# EAGLE schematic r_series (EAGLE 9.5.1)
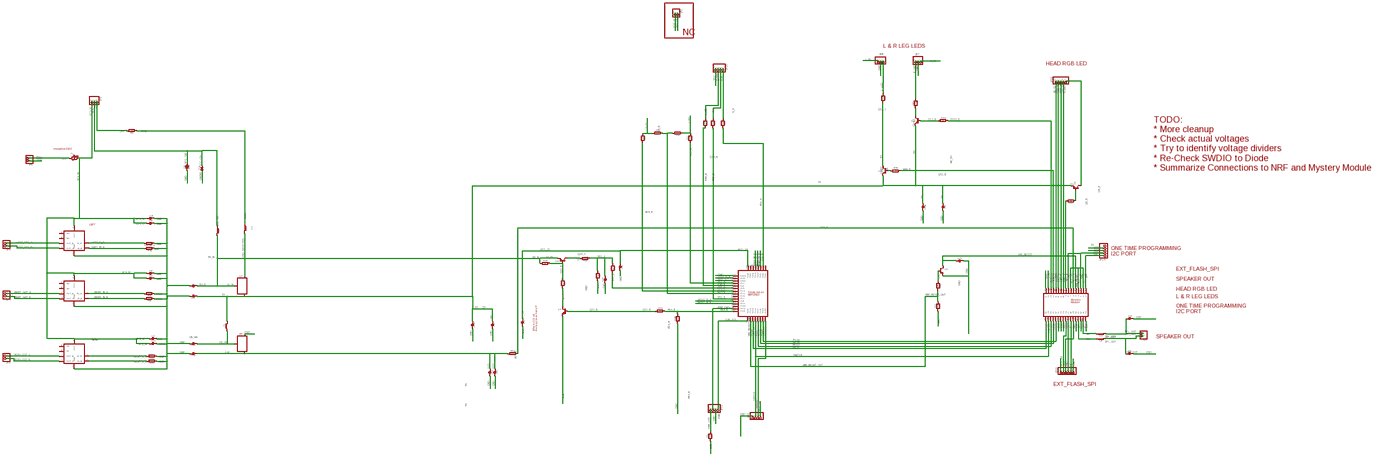
[diagram p0: schematic, sheet 1, overview]
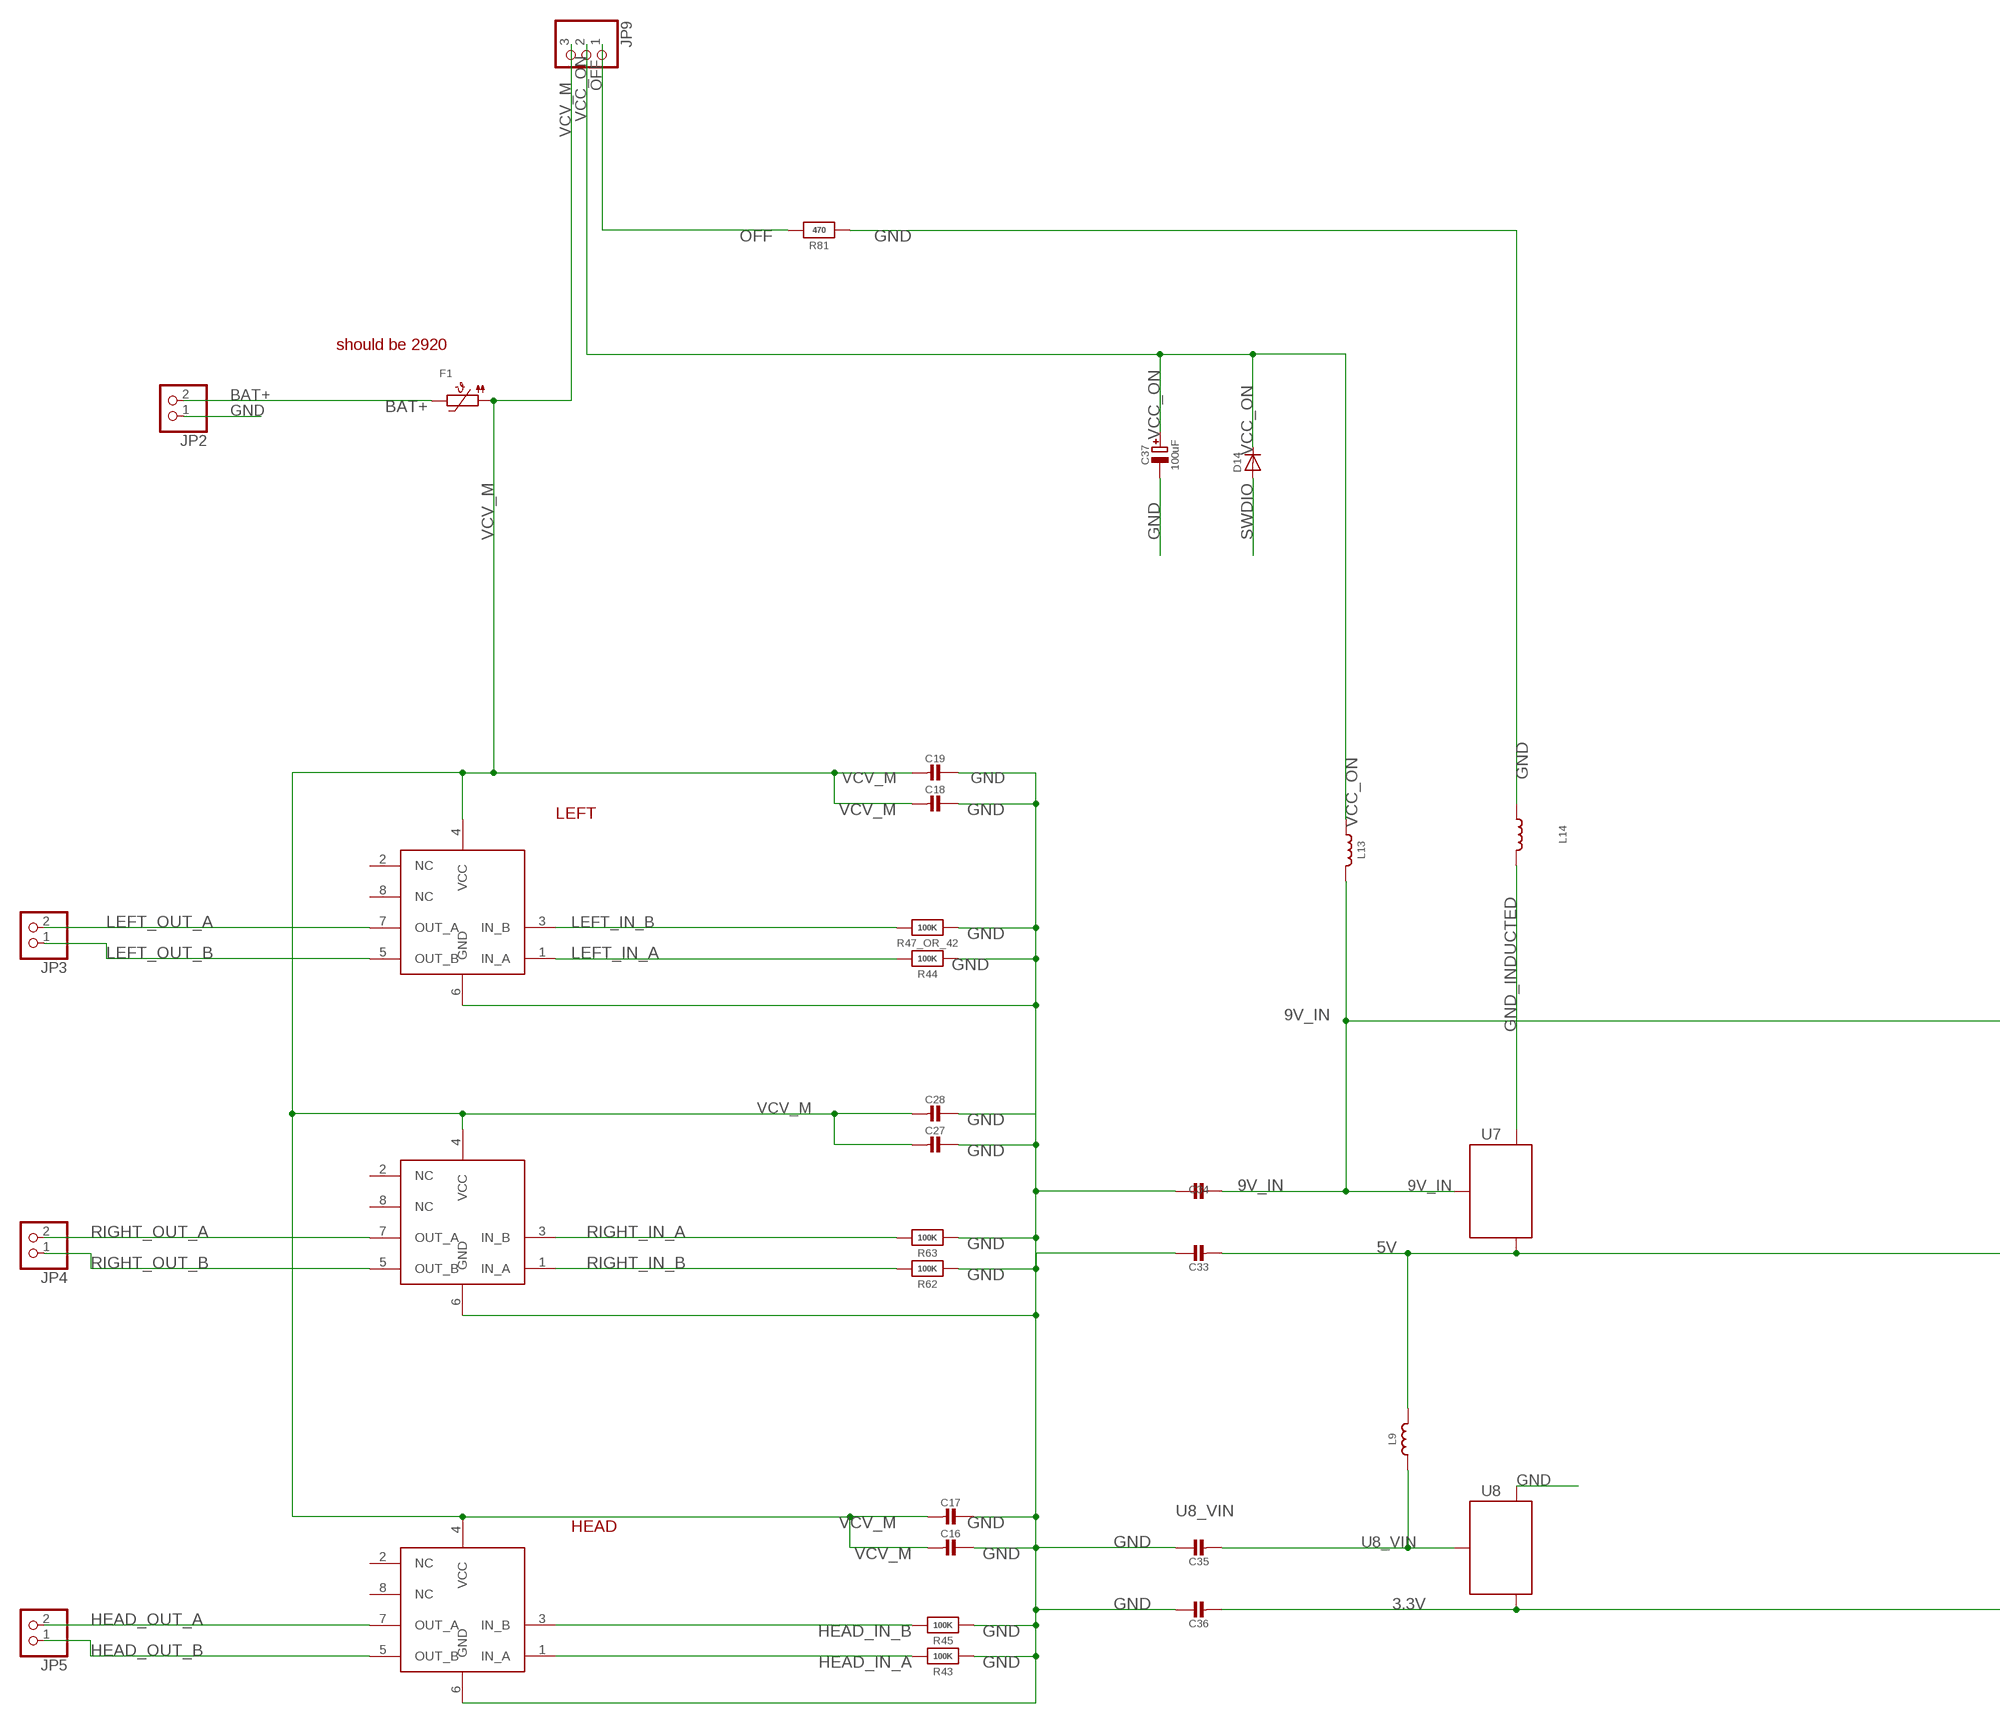
[diagram p1: schematic, sheet 1, part 1 of 4]
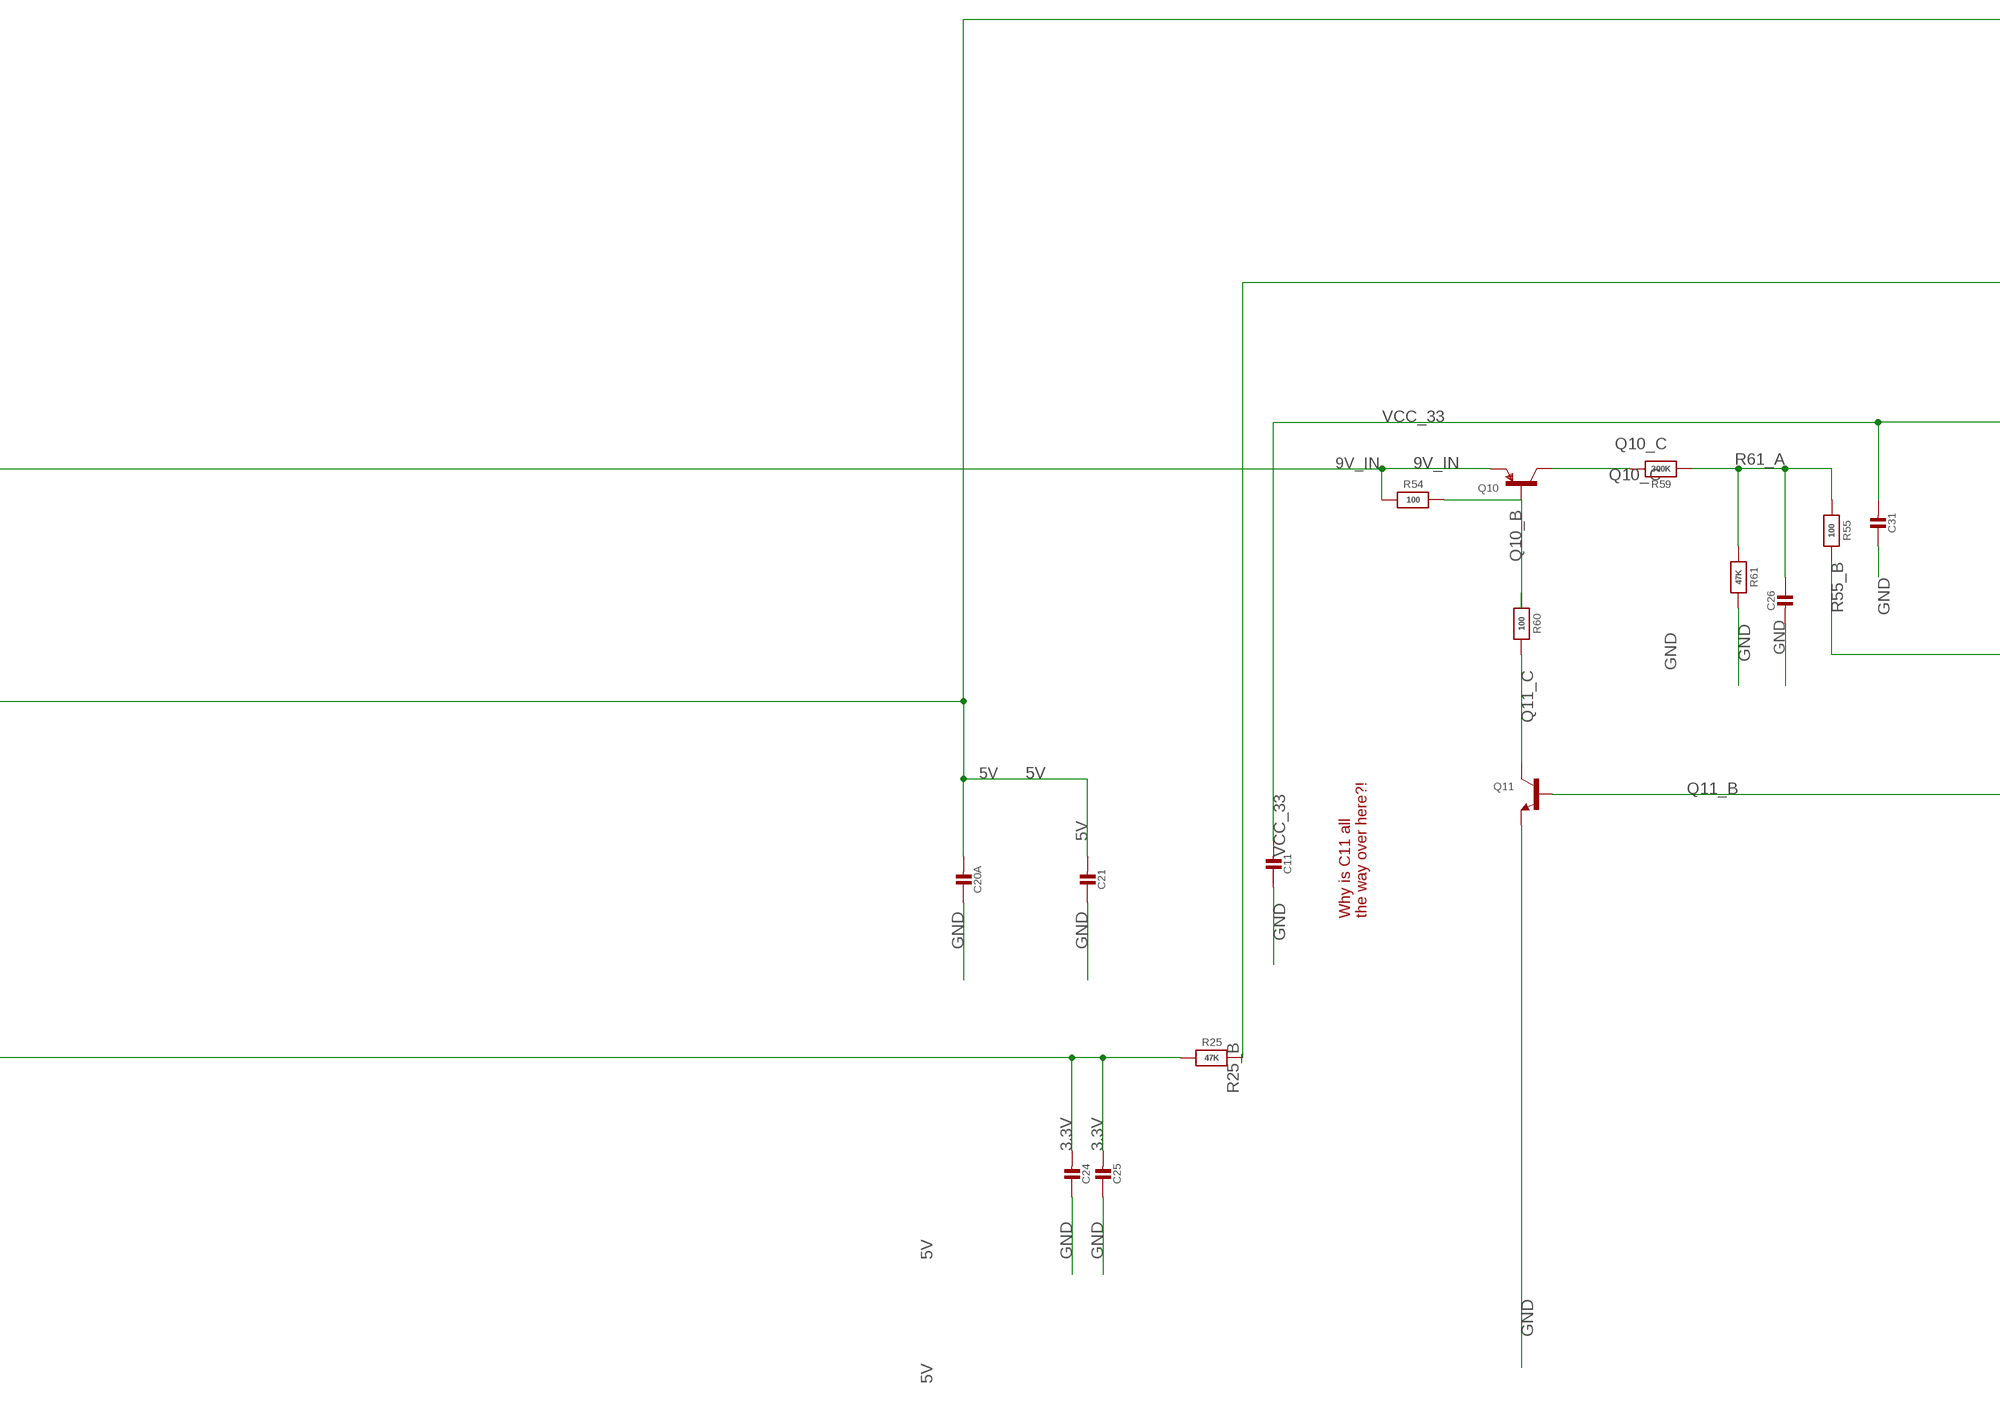
[diagram p2: schematic, sheet 1, part 2 of 4]
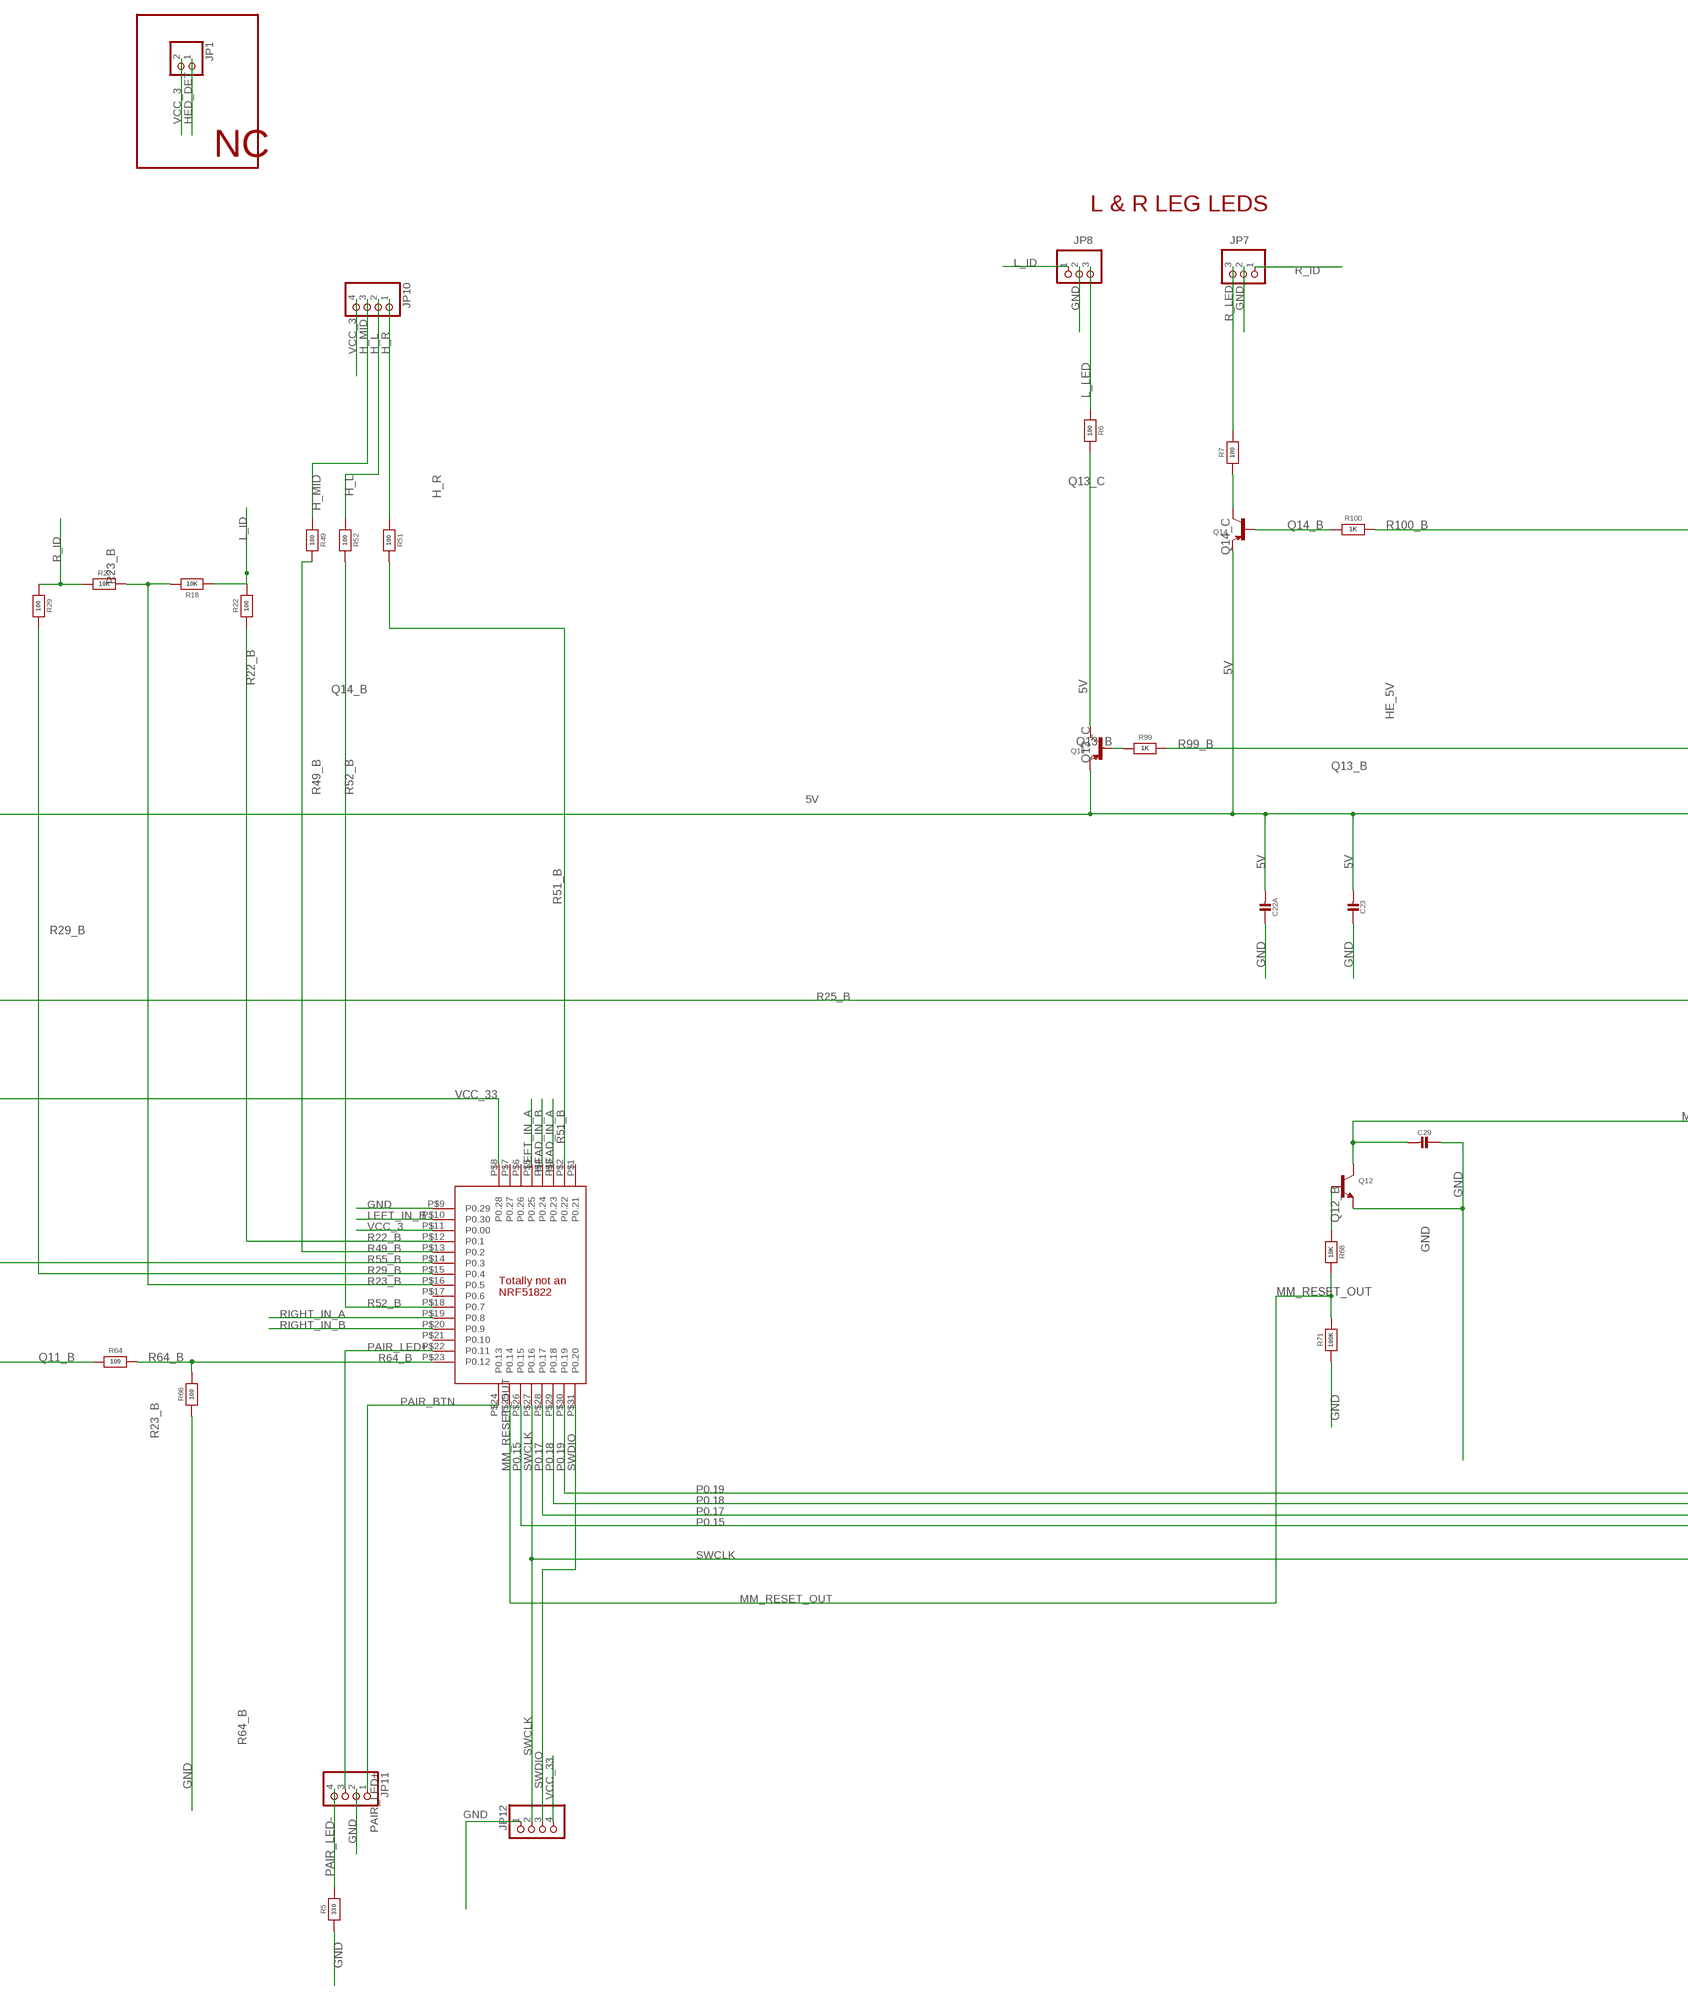
[diagram p3: schematic, sheet 1, part 3 of 4]
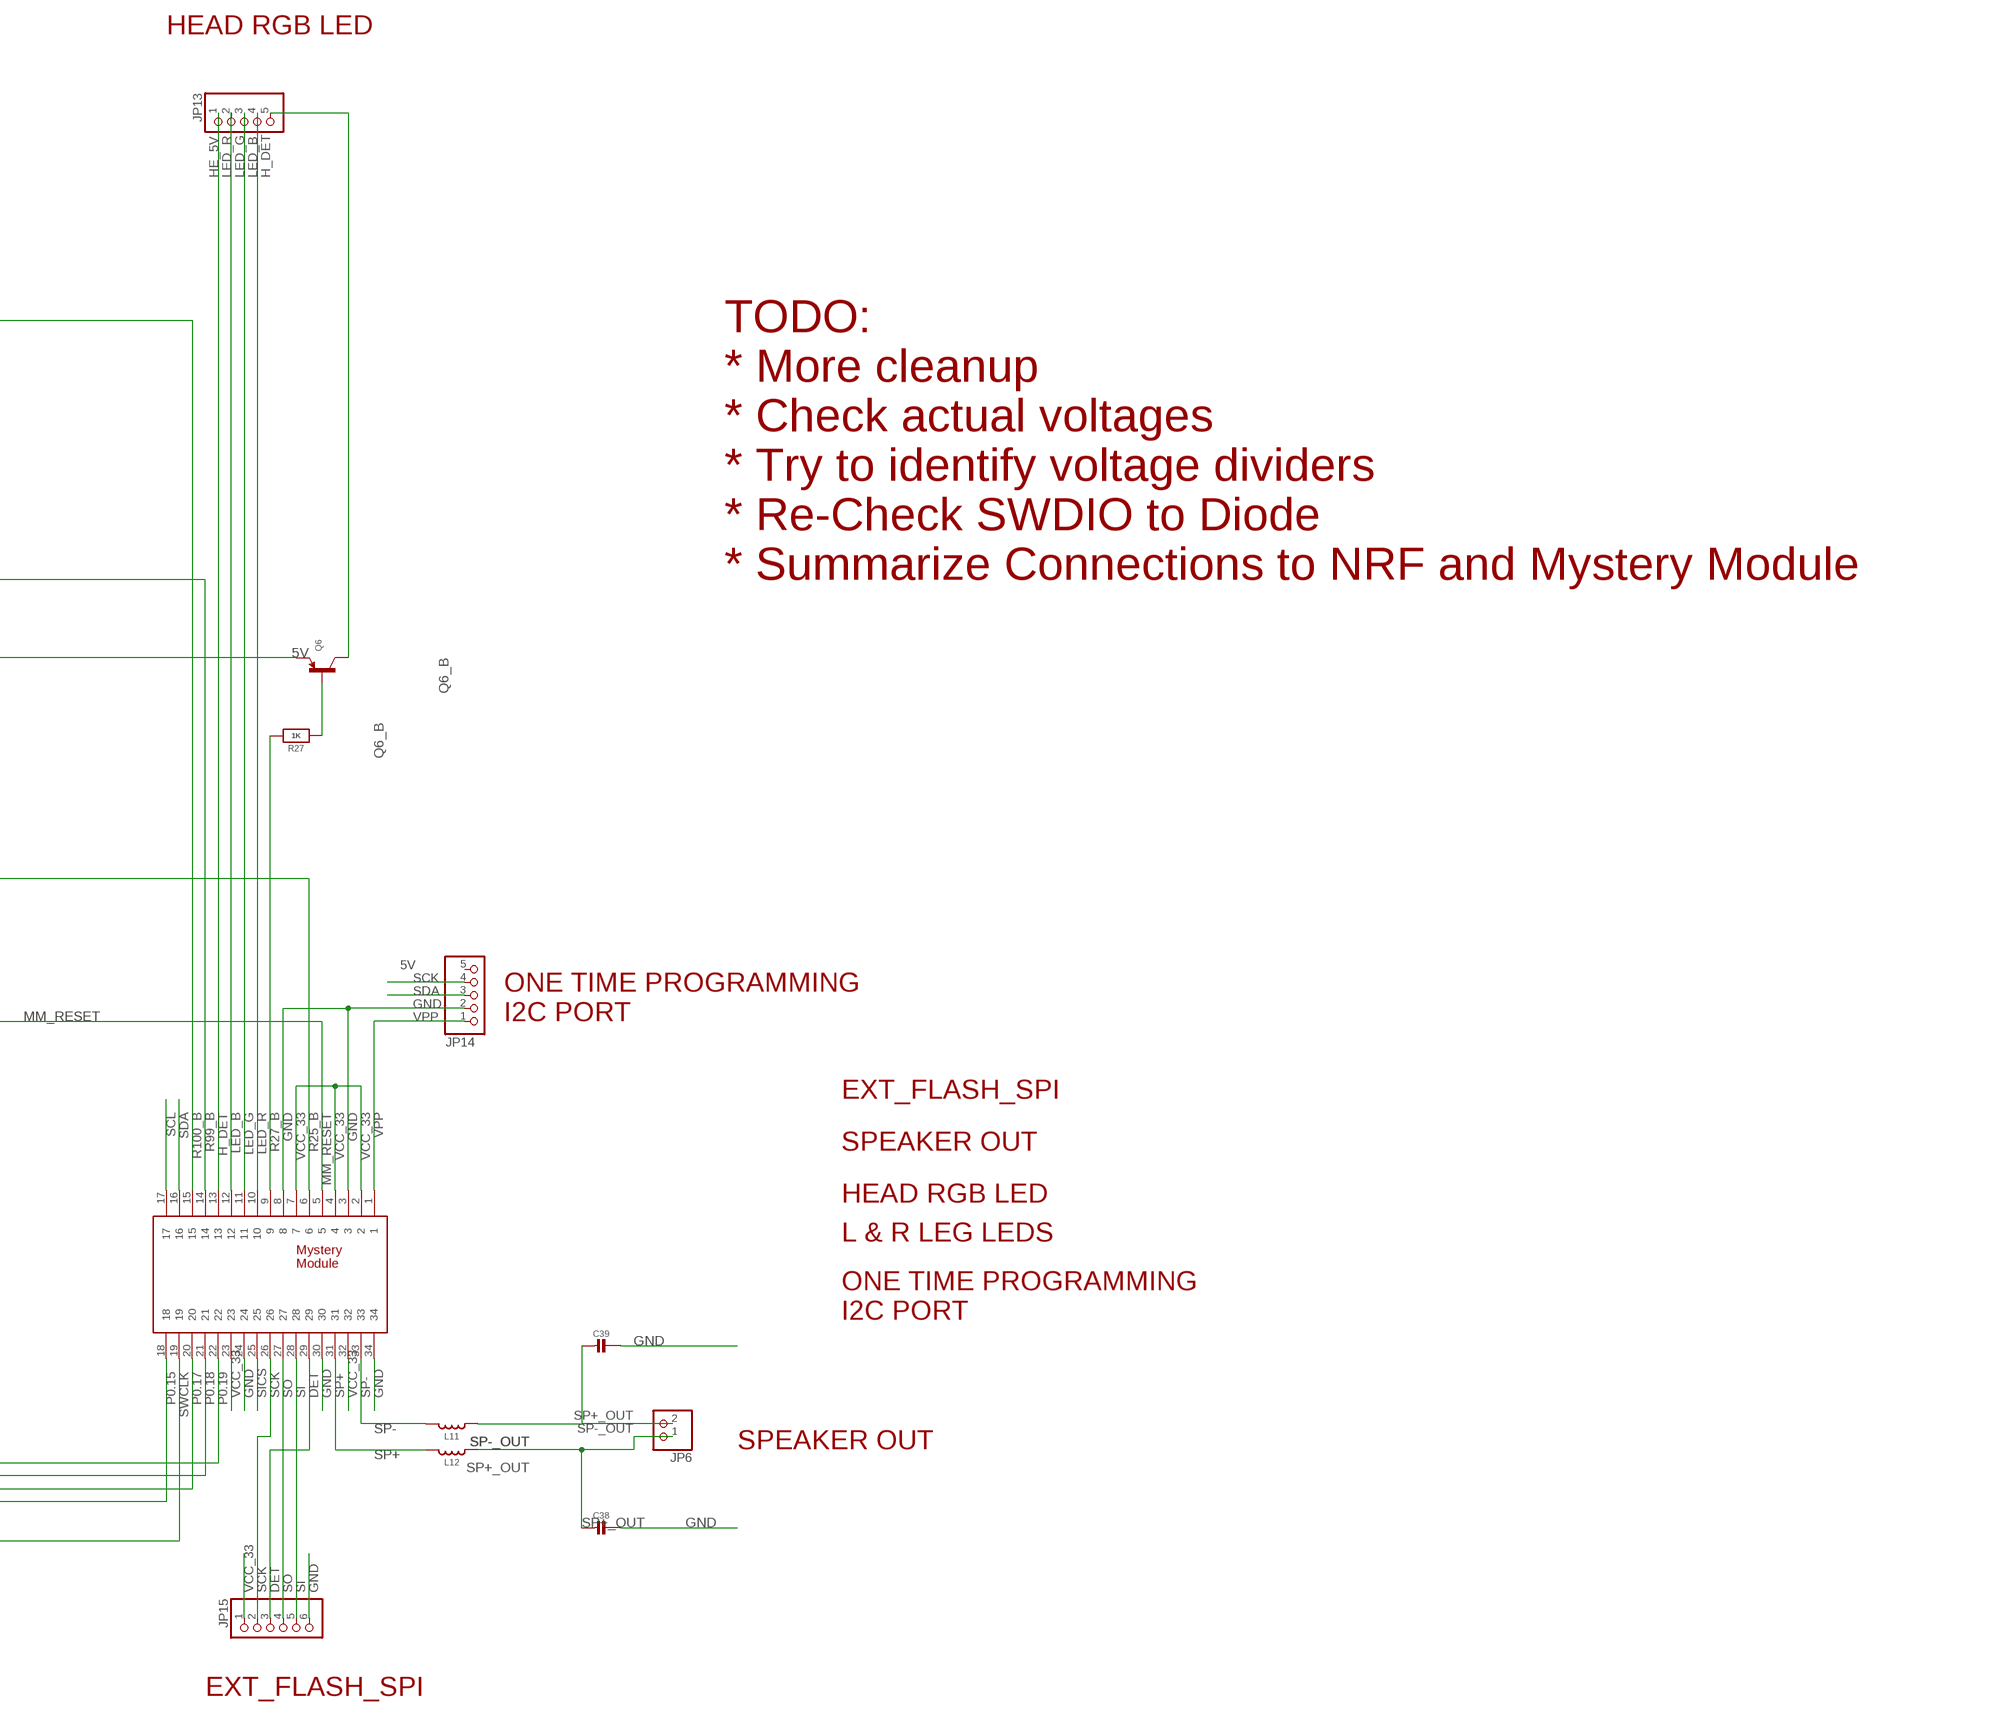
[diagram p4: schematic, sheet 1, part 4 of 4]

## Parts
C11  CAP_CERAMIC0603_NO  [0603-NO]
C16  CAP_CERAMIC0603_NO  [0603-NO]
C17  CAP_CERAMIC_0805MP  [_0805MP]
C18  CAP_CERAMIC0603_NO  [0603-NO]
C19  CAP_CERAMIC_0805MP  [_0805MP]
C20A  CAP_CERAMIC_0805MP  [_0805MP]
C21  CAP_CERAMIC0603_NO  [0603-NO]
C22A  CAP_CERAMIC_0805MP  [_0805MP]
C23  CAP_CERAMIC0603_NO  [0603-NO]
C24  CAP_CERAMIC0603_NO  [0603-NO]
C25  CAP_CERAMIC0603_NO  [0603-NO]
C26  CAP_CERAMIC0603_NO  [0603-NO]
C27  CAP_CERAMIC0603_NO  [0603-NO]
C28  CAP_CERAMIC_0805MP  [_0805MP]
C29  CAP_CERAMIC0603_NO  [0603-NO]
C31  CAP_CERAMIC0603_NO  [0603-NO]
C33  CAP_CERAMIC0603_NO  [0603-NO]
C34  CAP_CERAMIC0603_NO  [0603-NO]
C35  CAP_CERAMIC0603_NO  [0603-NO]
C36  CAP_CERAMIC0603_NO  [0603-NO]
C37  100uF  CAP_ELECTROLYTICPANASONIC_D  [PANASONIC_D]
C38  CAP_CERAMIC0603_NO  [0603-NO]
C39  CAP_CERAMIC0603_NO  [0603-NO]
D14  DIODESOD-323  [SOD-323]
F1  PTC1812  [PTC1812]
JP1  HEADER-1X2ROUND  [1X02_ROUND]
JP2  HEADER-1X2ROUND  [1X02_ROUND]
JP3  HEADER-1X2ROUND  [1X02_ROUND]
JP4  HEADER-1X2ROUND  [1X02_ROUND]
JP5  HEADER-1X2ROUND  [1X02_ROUND]
JP6  HEADER-1X2ROUND  [1X02_ROUND]
JP7  HEADER-1X3ROUND  [1X03_ROUND]
JP8  HEADER-1X3ROUND  [1X03_ROUND]
JP9  HEADER-1X3ROUND  [1X03_ROUND]
JP10  HEADER-1X4ROUND  [1X04_ROUND]
JP11  HEADER-1X4ROUND  [1X04_ROUND]
JP12  HEADER-1X4ROUND  [1X04_ROUND]
JP13  HEADER-1X5ROUND  [1X05_ROUND]
JP14  HEADER-1X5ROUND  [1X05_ROUND]
JP15  HEADER-1X6ROUND  [1X06_ROUND]
L9  INDUCTOR0805-NO  [0805-NO]
L11  INDUCTOR0603_NO  [0603-NO]
L12  INDUCTOR0603_NO  [0603-NO]
L13  INDUCTOR0805-NO  [0805-NO]
L14  INDUCTOR0805-NO  [0805-NO]
Q6  TRANSISTOR_PNPSOT23-REFLOW  [SOT23-R]
Q10  TRANSISTOR_PNPSOT23-REFLOW  [SOT23-R]
Q11  TRANSISTOR_NPNWIDE  [SOT23-WIDE]
Q12  TRANSISTOR_NPNWIDE  [SOT23-WIDE]
Q13  TRANSISTOR_PNPSOT23-REFLOW  [SOT23-R]
Q14  TRANSISTOR_PNPSOT23-REFLOW  [SOT23-R]
R5  330  RESISTOR_0603_NOOUT  [0603-NO]
R6  100  RESISTOR_0603_NOOUT  [0603-NO]
R7  100  RESISTOR_0603_NOOUT  [0603-NO]
R18  10K  RESISTOR_0603_NOOUT  [0603-NO]
R22  100  RESISTOR_0603_NOOUT  [0603-NO]
R23  10K  RESISTOR_0603_NOOUT  [0603-NO]
R25  47K  RESISTOR_0603_NOOUT  [0603-NO]
R27  1K  RESISTOR_0603_NOOUT  [0603-NO]
R29  100  RESISTOR_0603_NOOUT  [0603-NO]
R43  100K  RESISTOR_0603_NOOUT  [0603-NO]
R44  100K  RESISTOR_0603_NOOUT  [0603-NO]
R45  100K  RESISTOR_0603_NOOUT  [0603-NO]
R47_OR_42  100K  RESISTOR_0603_NOOUT  [0603-NO]
R49  100  RESISTOR_0603_NOOUT  [0603-NO]
R51  100  RESISTOR_0603_NOOUT  [0603-NO]
R52  100  RESISTOR_0603_NOOUT  [0603-NO]
R54  100  RESISTOR_0603_NOOUT  [0603-NO]
R55  100  RESISTOR_0603_NOOUT  [0603-NO]
R59  300K  RESISTOR_0603_NOOUT  [0603-NO]
R60  100  RESISTOR_0603_NOOUT  [0603-NO]
R61  47K  RESISTOR_0603_NOOUT  [0603-NO]
R62  100K  RESISTOR_0603_NOOUT  [0603-NO]
R63  100K  RESISTOR_0603_NOOUT  [0603-NO]
R64  100  RESISTOR_0603_NOOUT  [0603-NO]
R66  100  RESISTOR_0603_NOOUT  [0603-NO]
R68  10K  RESISTOR_0603_NOOUT  [0603-NO]
R71  100K  RESISTOR_0603_NOOUT  [0603-NO]
R81  470  RESISTOR_0805MP  [_0805MP]
R99  1K  RESISTOR_0603_NOOUT  [0603-NO]
R100  1K  RESISTOR_0603_NOOUT  [0603-NO]
U7  ME62XX  [SOT89]
U8  ME62XX  [SOT89]
U$1  AM1037A  [SOIC8_208MIL]
U$2  AM1037A  [SOIC8_208MIL]
U$3  AM1037A  [SOIC8_208MIL]
U$4  KNRF51822_A24  [KNRF51822]
U$5  GPCD9TP340A_DROID  [GPCD9TP340A]

## Nets
3.3V: C24.2 C25.2 C36.2 R25.1 U8.2(VOUT) U8.2@1(VOUT)
5V: C20A.2 C21.2 C22A.2 C23.2 C33.2 L9.2 Q6.2(E) Q13.2(E) Q14.2(E) U7.2(VOUT) U7.2@1(VOUT)
9V_IN: C34.2 L13.2 Q10.2(E) R54.1 U7.1(VSS)
BAT+: F1.P$2 JP2.2
DET: JP15.3 U$5.29
GND: C11.1 C16.1 C17.1 C18.1 C19.1 C20A.1 C21.1 C22A.1 C23.1 C24.1 C25.1 C26.2 C27.1 C28.1 C29.1 C31.1 C33.1 C34.1 C35.1 C36.1 C37.- C38.1 C39.1 JP2.1 JP7.2 JP8.2 JP11.2 JP12.1 JP14.2 JP15.6 L14.1 Q11.2(E) Q12.2(E) R5.1 R43.1 R44.1 R45.1 R47_OR_42.1 R61.2 R62.1 R63.1 R66.1 R71.1 R81.1 U8.3(VIN) U$1.6(GND) U$2.6(GND) U$3.6(GND) U$4.P$9(P0.29) U$5.3 U$5.8 U$5.24 U$5.30 U$5.34
GND_INDUCTED: L14.2 U7.3(VIN)
H_DET: JP13.1 U$5.13
H_L: JP10.2 R52.1
H_MID: JP10.3 R49.1
H_R: JP10.1 R51.1
HE_5V: JP13.5 Q6.3(C)
HEAD_IN_A: R43.2 U$3.1(IN_A) U$4.P$3(P0.23)
HEAD_IN_B: R45.2 U$3.3(IN_B) U$4.P$4(P0.24)
HEAD_OUT_A: JP5.2 U$3.7(OUT_A)
HEAD_OUT_B: JP5.1 U$3.5(OUT_B)
HED_DET: JP1.1
L_ID: JP8.1 R18.1 R22.1
L_LED: JP8.3 R6.1
LED_B: JP13.2 U$5.12
LED_G: JP13.3 U$5.11
LED_R: JP13.4 U$5.10
LEFT_IN_A: R44.2 U$1.1(IN_A) U$4.P$5(P0.25)
LEFT_IN_B: R47_OR_42.2 U$1.3(IN_B) U$4.P$10(P0.30)
LEFT_OUT_A: JP3.2 U$1.7(OUT_A)
LEFT_OUT_B: JP3.1 U$1.5(OUT_B)
MM_RESET: C29.2 Q12.3(C) U$5.5
MM_RESET_OUT: R68.2 R71.2 U$4.P$25(P0.14)
OFF: JP9.1 R81.2
P0.15: U$4.P$26(P0.15) U$5.18
P0.17: U$4.P$28(P0.17) U$5.20
P0.18: U$4.P$29(P0.18) U$5.21
P0.19: U$4.P$30(P0.19) U$5.22
PAIR_BTN: JP11.1 U$4.P$24(P0.13)
PAIR_LED+: JP11.3 U$4.P$22(P0.11)
PAIR_LED-: JP11.4 R5.2
Q6_B: Q6.1(B) R27.1
Q10_B: Q10.1(B) R54.2 R60.2
Q10_C: Q10.3(C) R59.2
Q11_B: Q11.1(B) R64.1
Q11_C: Q11.3(C) R60.1
Q12_B: Q12.1(B) R68.1
Q13_B: Q13.1(B) R99.1
Q13_C: Q13.3(C) R6.2
Q14_B: Q14.1(B) R100.1
Q14_C: Q14.3(C) R7.1
R22_B: R22.2 U$4.P$12(P0.1)
R23_B: R18.2 R23.2 U$4.P$16(P0.5)
R25_B: R25.2 U$5.6
R27_B: R27.2 U$5.9
R29_B: R29.2 U$4.P$15(P0.4)
R49_B: R49.2 U$4.P$13(P0.2)
R51_B: R51.2 U$4.P$2(P0.22)
R52_B: R52.2 U$4.P$18(P0.7)
R55_B: R55.2 U$4.P$14(P0.3)
R61_A: C26.1 R55.1 R59.1 R61.1
R64_B: R64.2 R66.2 U$4.P$23(P0.12)
R99_B: R99.2 U$5.14
R100_B: R100.2 U$5.15
R_ID: JP7.1 R23.1 R29.1
R_LED: JP7.3 R7.2
RIGHT_IN_A: R62.2 U$2.1(IN_A) U$4.P$19(P0.8)
RIGHT_IN_B: R63.2 U$2.3(IN_B) U$4.P$20(P0.9)
RIGHT_OUT_A: JP4.2 U$2.7(OUT_A)
RIGHT_OUT_B: JP4.1 U$2.5(OUT_B)
SCK: JP14.4 JP15.2 U$5.26
SCL: U$5.17
SDA: JP14.3 U$5.16
SI: JP15.5 U$5.28
SICS: U$5.25
SO: JP15.4 U$5.27
SP+: L12.2 U$5.31
SP+_OUT: C38.2 JP6.1 L12.1
SP-: L11.2 U$5.33
SP-_OUT: C39.2 JP6.2 L11.1
SWCLK: JP12.2 U$4.P$27(P0.16) U$5.19
SWDIO: D14.A JP12.3 U$4.P$31(P0.20)
U8_VIN: C35.2 L9.1 U8.1(VSS)
VCC_3: JP1.2 JP10.4 U$4.P$11(P0.00)
VCC_33: C11.2 C31.2 JP12.4 JP15.1 U$4.P$8(P0.28) U$5.2 U$5.4 U$5.7 U$5.23 U$5.32
VCC_ON: C37.+ D14.C JP9.2 L13.1
VCV_M: C16.2 C17.2 C18.2 C19.2 C27.2 C28.2 F1.P$1 JP9.3 U$1.4(VCC) U$2.4(VCC) U$3.4(VCC)
VPP: JP14.1 U$5.1
Unconnected: JP14.5 U$1.2(NC) U$1.8(NC) U$2.2(NC) U$2.8(NC) U$3.2(NC) U$3.8(NC) U$4.P$1(P0.21) U$4.P$6(P0.26) U$4.P$7(P0.27) U$4.P$17(P0.6) U$4.P$21(P0.10)

## Notes on the sheet
- NC
- L & R LEG LEDS
- HEAD RGB LED
- should be 2920
- TODO:
  * More cleanup
  * Check actual voltages
  * Try to identify voltage dividers
  * Re-Check SWDIO to Diode
  * Summarize Connections to NRF and Mystery Module
- LEFT
- ONE TIME PROGRAMMING
  I2C PORT
- EXT_FLASH_SPI
- SPEAKER OUT
- HEAD RGB LED
- Totally not an
  NRF51822
- L & R LEG LEDS
- Mystery
  Module
- ONE TIME PROGRAMMING
  I2C PORT
- Why is C11 all
  the way over here?!
- SPEAKER OUT
- HEAD
- EXT_FLASH_SPI

## Library data of the parts
C11 C16-C19 C20A C21 C22A C23-C29 C31 C33-C36 C38 C39 = DROID:CAP_CERAMIC: Ceramic Capacitors For new designs, use the packages preceded by an '_' character since they are more reliable: The following footprints should be used on most boards: _0402 - Standard footprint for regular board layouts _0603 - Standard footprint for regular board layouts _0805 - Standard footprint for regular board layouts _1206 - Standard footprint for regular board layouts For extremely tight-pitch boards where space is at a premium, the following 'micro-pitch' footprints can be used (smaller pads, no silkscreen outline, etc.): _0402MP - Micro-pitch footprint for very dense/compact boards _0603MP - Micro-pitch footprint for very dense/compact boards _0805MP - Micro-pitch footprint for very dense/compact boards _1206MP - Micro-pitch footprint for very dense/compact boards
C37 = DROID:CAP_ELECTROLYTIC: Electrolytic Capacitors SMT PANASONIC_C - Size C Panasonic Electrolytic Aluminum Capacitor 47µF 16V 20% Electrolytic Capacitor [Digikey: PCE3890TR-ND] PANASONIC_D - Size D Panasonic Electrolytic Aluminum Capacitor 100µF 25V 20% Electrolytic Capacitor [Digikey: PCE3898TR-ND] PTH 3.5 mm grid, 8 mm diameter ... 3.5 mm grid, 10 mm diameter ...
D14 = DROID:DIODE: Diode SMA Model Volts Amps Type Vf Ir Digikey # Notes SSA34-E3 40V 3A Schottky 480mV @ 3A 200uA @ 40V SSA34-E3/61TGITR-ND CDBA120-G 20V 1A Schottky 500mV @ 1A 500uA @ 20V 641-1014-6-ND REEL MBRA210 10V 2A Schottky 350mV @ 2A 700uA @ 10V MBRA210LT3 SOD-123 Model Volts Amps Type Vf Ir Order # Notes BAT54T1G 30V 200mA Schottky 800mV @ 200mA 2uA @ 25V BAT54T1GOSTR-ND B0530W 30V 500mA Schottky 430mV @ 500mA 130uA @ 30V B0530W-FDICT-ND REEL MBR120 20V 1A Schottky 340mV @ 1A MBR120VLSFT1GOSCT-ND SOD-323 Model Volts Amps Type Vf Ir Order # Notes PMEG2005EJ 20V 500mA Schottky 355mV @ 500mA 568-4110-1-ND ZLLS410 10V 570mA Schottky 380mV @ 570mA ZLLS410CT-ND 1N4148WS 75V 150mA Silicon/Simple 1V 1N4148WSFSCT-ND REEL SOD-523 Model Volts Amps Type Vf Ir Order # Notes BAT54XV2 30V 200mA Schottky 0.8V @ 100mA BAT54XV2CT-ND TB751S 30V 30mA Schottky RB751S-40TE61CT-ND SOT23-R/W (R = Solder Paste/Reflow Ovens, W = Hand-Soldering) Model Volts Amps Type Vf Ir Order # Notes BAT54FILM 40V 300mA Schottky 497-7162-1-ND POWERDI-5 Model Volts Amps Type Vf Ir Order # Notes PDS560 60V 5A Schottky 670mV @ 5A 150uA @ 60V PDS560DICT-ND
F1 = DROID:PTC: PTC (Resettable Fuse) 1206 Package 250mA PTC (16V Max, Time-to-Trip: 0.08s) - Digikey: F2110CT-ND 1210 Package 100mA PTC (30V Max, Time-to-Trip: 0.6s) - Digikey: MF-USMF010-2CT-ND 1812 Package 750mA PTC (24V Max, Time-to-Trip: 0.2s) - Digikey: MF-MSMF075/24-2CT-ND
JP1-JP6 = DROID:HEADER-1X2: PIN HEADER
JP7-JP9 = DROID:HEADER-1X3: PIN HEADER
JP10-JP12 = DROID:HEADER-1X4: PIN HEADER
JP13 JP14 = DROID:HEADER-1X5: PIN HEADER
JP15 = DROID:HEADER-1X6: PIN HEADER
L9 L11-L14 = DROID:INDUCTOR: Inductors 0603: 10nH Ceramic Inductor - microwire antenna/RF (Digikey: 712-1434-2-ND) 0805: 560nH Ceramic Inductor - RF (Digikey: 553-1047-1-ND) 270nH Ceramic Inductor - Q = 40@250MHz, +-5%, 1 Ohm DC Resistance (Digikey: 535-10506-2-ND) 1007 (2518 Metric) SMT: 10µH 10% 250mOhm 820mA 1007 Inductor (Digikey: 587-2189-1-ND) 22µH 10% 500mOhm 580mA 1007 Inductor (Digikey: 587-2190-1-ND) 47µH 10% 950mOhm 420mA 1007 Inductor (Digikey: 587-2191-1-ND) 47µH 5% 100mOhm 1A 1008 Inductor (Digikey: 732-1816-1-ND) 5.0x5.0mm (Taiyo Yuden NR5040 Series) 6.8µH 20% 2.3A 64mOhm Inductor (Digikey: 587-2374-2-ND) 5.0x5.0mm (TDK VLC5045 Series) 4.7µH 20% 3.3A 34mOhm Inductor (Digikey: 445-6526-1-ND) 6.8µH 20% 2.7A 46mOhm Inductor (Digikey: 445-6527-1-ND) 6.0x6.0mm (TDK VLC6045 Series) 4.7µH 20% 3.8A 27mOhm Inductor (Digikey: 445-6538-2-ND) 6.8µH 20% 3A 41mOhm Inductor (Digikey: 445-6540-1-ND) 6.2µH 30% 2.2A 45mOhm Inductor (Digikey: SRR5028-6R2YCT-ND) - Not TDK VLC6045 but footprint should match 6.0x6.0mm (TDK SLF6045 Series) 6.8uH 30% 2A 33mOhm Inductor (Digikey: 445-4572-1-ND, Mouser: 810-SLF645T6R8N2R0PF) 6.0x6.0mm (Sumida CDRH5D28 Series) 6.2uH 30% 1.8A 45mOhm Inductor (Digikey: 308-1542-1-ND) Taiyo Yuden NR3015T2R2M - 2.2uH 20% 1.5A (Digikey: 587-1648-2-ND, Mouser: 963-NR3015T2R2M) - Used with TI TPS62172 CoilCraft RFID Transponder Coil - MA5532-AE (For use with AS3935 Lightning Sensor) Taiyo Yuden NRH2412T2R2MNGH - 2.2uH 20% 1AA (Digikey: 587-3443-1-ND) - Used with TI LM3671 Vishay IHLP 1.0uH Molded Inductor - 24mOhm DCR, 5A, +/-20%, -55°C-125°C (Digikey: 541-1319-1-ND)
Q6 Q10 Q13 Q14 = DROID:TRANSISTOR_PNP: PNP Transistor Transistor (PNP) 800mA 60V, 1.6V VCE @ 500mA [Digikey: MMBT2907AFSTR-ND] Transistor (PNP) Low Sat - 1.5A 20V, 260mV VCE @ 400mA [Digikey: ZXTP25020DFLTR-ND] SOT23-R - SOT23 footprint optimised for use with solder paste and reflow ovens. SOT23-W - SOT23 footprint optimised for hand-soldering (larger pads).
Q11 Q12 = DROID:TRANSISTOR_NPN: NPN Transistor Transistor (NPN) 500mA 45V - BC817 [Digikey: 568-1631-1-ND] Transistor (NPN) 500mA 45V - BC817,215 [Mouser: 771-BC817-T/R] SOT23-R - SOT23 footprint optimised for use with solder paste and reflow ovens. SOT23-W - SOT23 footprint optimised for hand-soldering (larger pads).
R5-R7 R18 R22 R23 R25 R27 R29 R43-R45 R47_OR_42 R49 R51 R52 R54 R55 R59-R64 R66 R68 R71 R81 R99 R100 = DROID:RESISTOR: Resistors For new designs, use the packages preceded by an '_' character since they are more reliable: The following footprints should be used on most boards: _0402 - Standard footprint for regular board layouts _0603 - Standard footprint for regular board layouts _0805 - Standard footprint for regular board layouts _1206 - Standard footprint for regular board layouts For extremely tight-pitch boards where space is at a premium, the following 'micro-pitch' footprints can be used (smaller pads, no silkscreen outline, etc.): _0402MP - Micro-pitch footprint for very dense/compact boards _0603MP - Micro-pitch footprint for very dense/compact boards _0805MP - Micro-pitch footprint for very dense/compact boards _1206MP - Micro-pitch footprint for very dense/compact boards
U7 U8 = DROID:ME62XX: PNP TRANSISTOR; MPN: 2DB1713-13; OC_FARNELL: 1710687; OC_NEWARK: 25R5670
U$1-U$3 = DROID:AM1037A
U$4 = DROID:KNRF51822_A24
U$5 = DROID:GPCD9TP340A_DROID